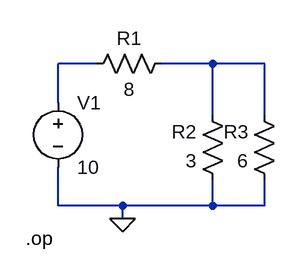
[diagram p0: schematic DC ANALYSIS.asc]
DC ANALYSIS.asc, the LTspice schematic file:
Version 4
SHEET 1 880 680
WIRE 192 96 144 96
WIRE 336 96 272 96
WIRE 400 96 336 96
WIRE 144 144 144 96
WIRE 336 160 336 96
WIRE 400 160 400 96
WIRE 144 272 144 224
WIRE 224 272 144 272
WIRE 336 272 336 240
WIRE 336 272 224 272
WIRE 400 272 400 240
WIRE 400 272 336 272
WIRE 224 288 224 272
FLAG 224 288 0
SYMBOL voltage 144 128 R0
SYMATTR InstName V1
SYMATTR Value 10
SYMBOL res 288 80 R90
WINDOW 0 0 56 VBottom 2
WINDOW 3 32 56 VTop 2
SYMATTR InstName R1
SYMATTR Value 8
SYMBOL res 352 256 R180
WINDOW 0 36 76 Left 2
WINDOW 3 36 40 Left 2
SYMATTR InstName R2
SYMATTR Value 3
SYMBOL res 416 256 R180
WINDOW 0 36 76 Left 2
WINDOW 3 36 40 Left 2
SYMATTR InstName R3
SYMATTR Value 6
TEXT 104 312 Left 2 !.op

The netlist it stands for:
* DC ANALYSIS.asc
V1 N001 0 10
R1 N002 N001 8
R2 0 N002 3
R3 0 N002 6
.op
.backanno
.end